# Altium schematic sheet RelayModule_CAN.SchDoc
size 420 x 297 mm; DocumentNumber: VSL.23-RELAYMODULE Э3; SheetNumber: 3; Format: A3
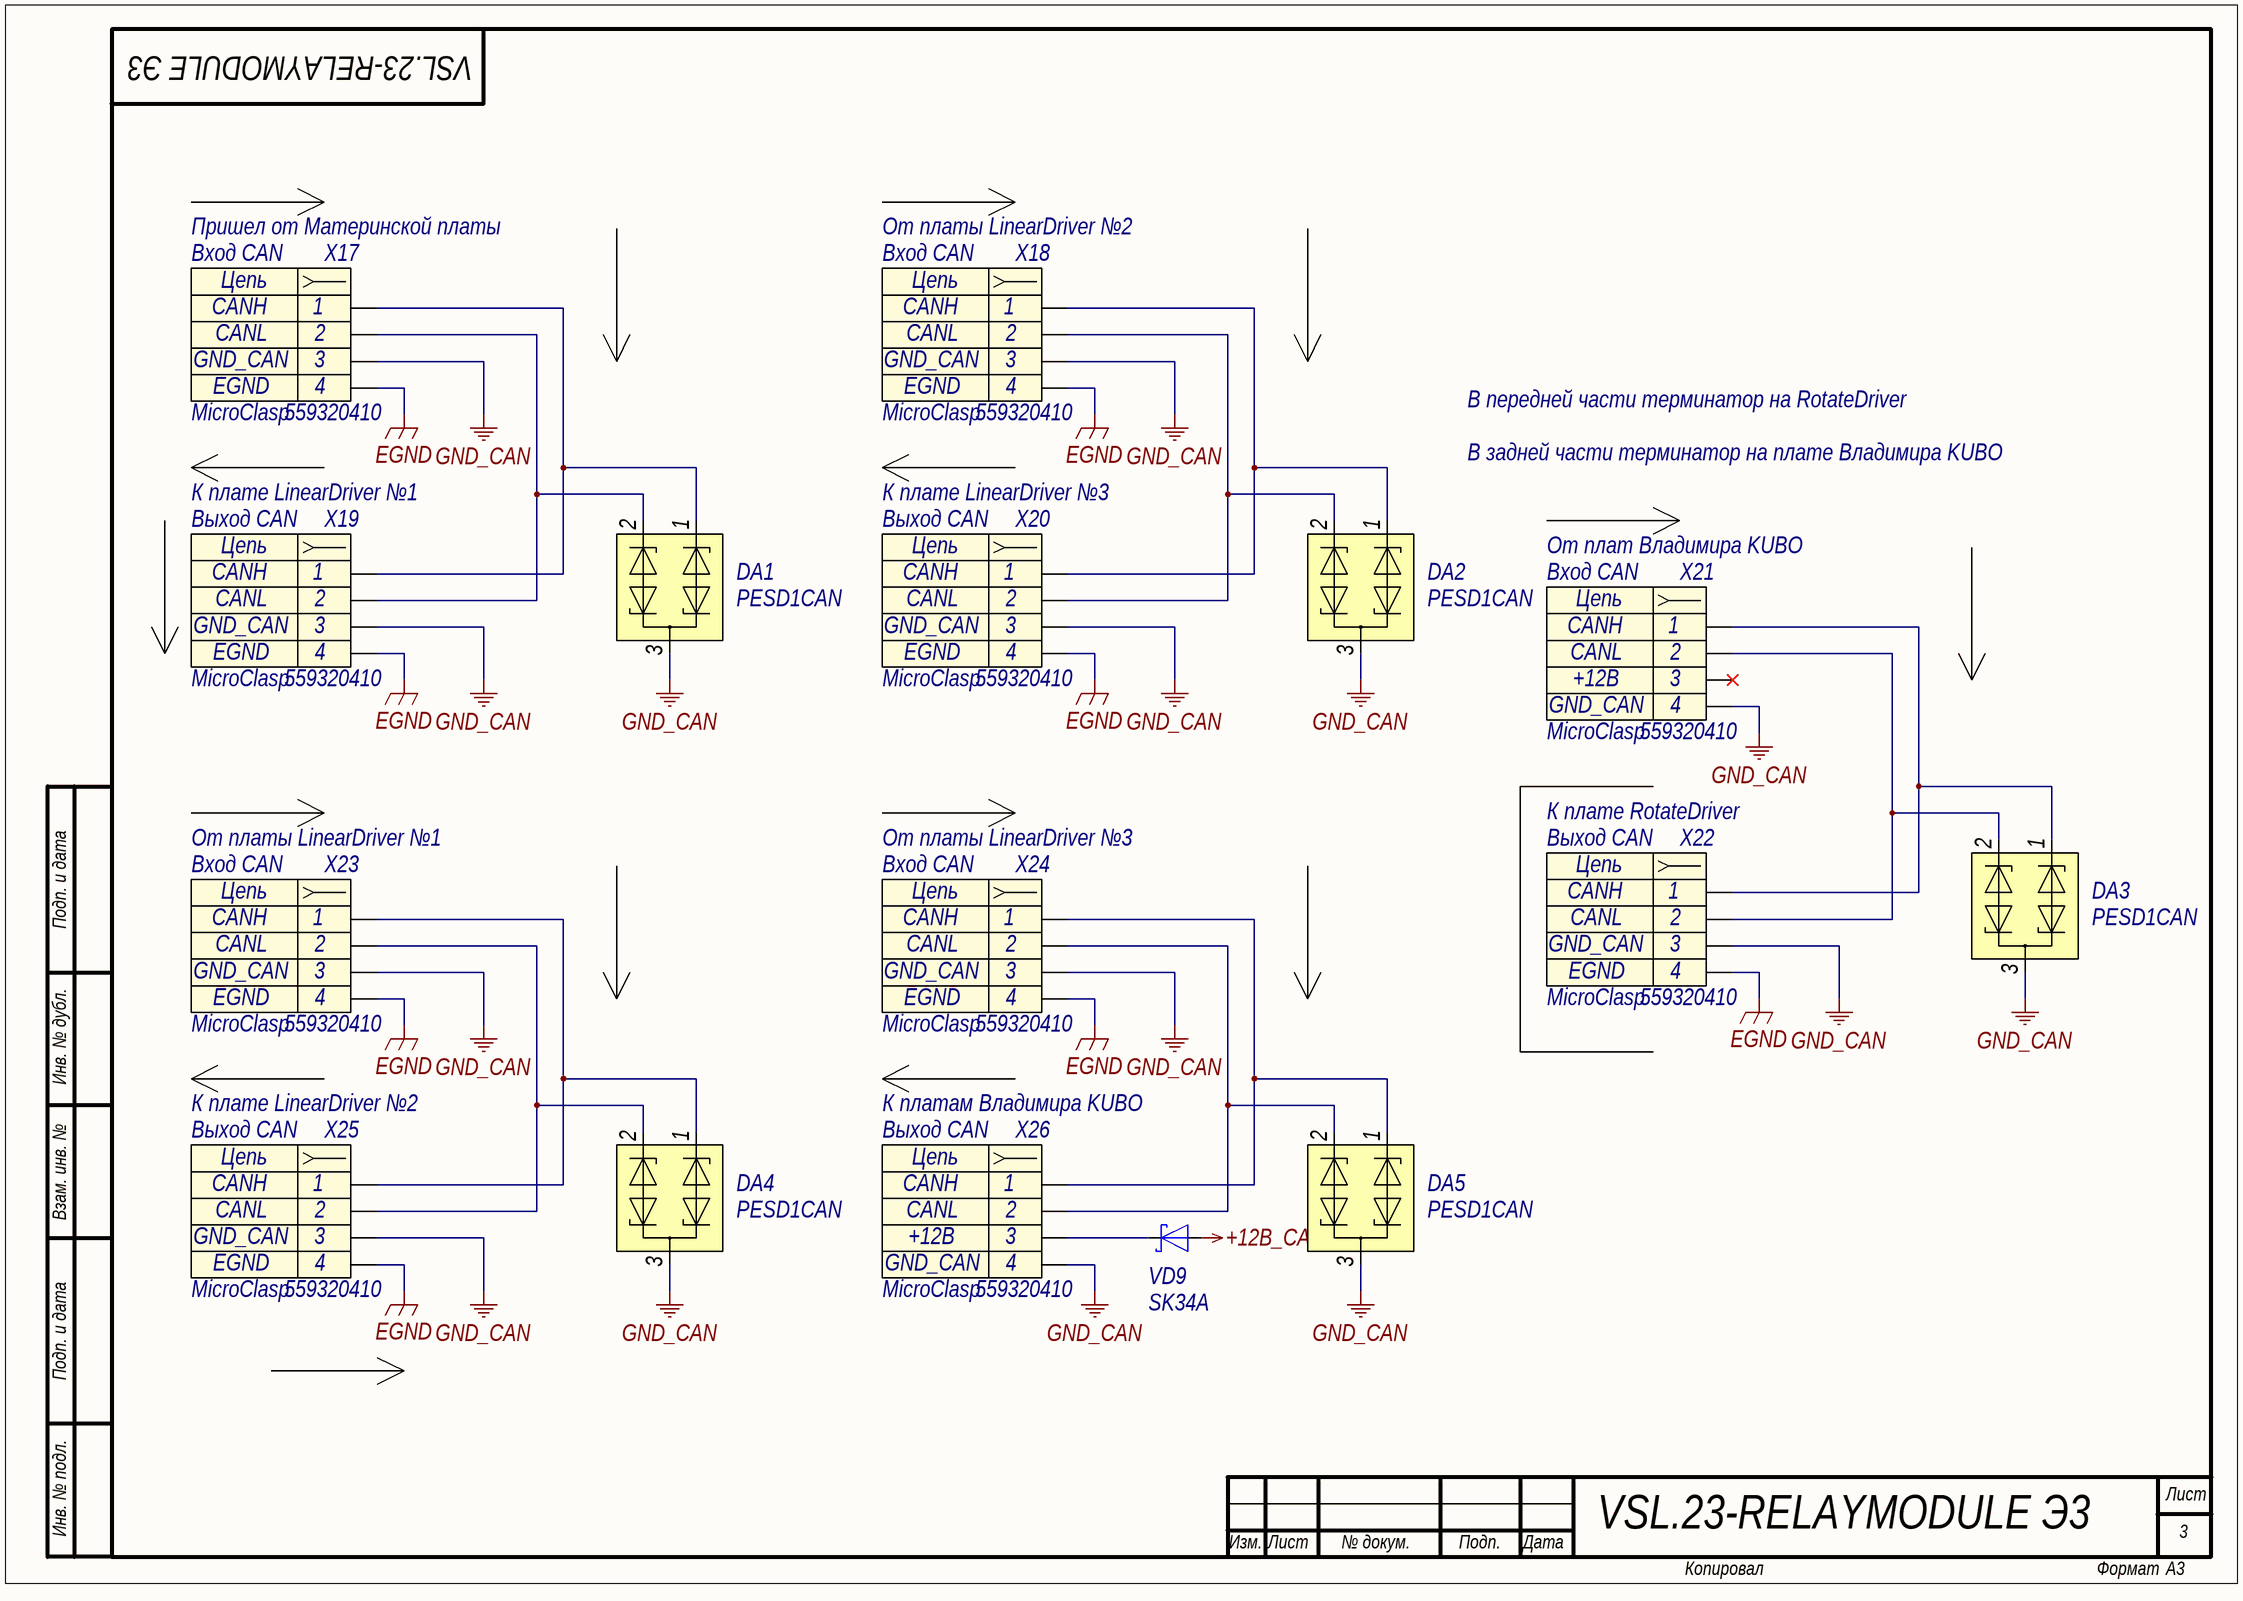
[diagram p0: RelayModule_CAN.SchDoc]

## Parts
DA1  Part Number: PESD1CAN  [SOT23-3]  (hidden comment: PESD)
DA2  Part Number: PESD1CAN  [SOT23-3]  (hidden comment: PESD)
DA3  Part Number: PESD1CAN  [SOT23-3]  (hidden comment: PESD)
DA4  Part Number: PESD1CAN  [SOT23-3]  (hidden comment: PESD)
DA5  Part Number: PESD1CAN  [SOT23-3]  (hidden comment: PESD)
VD9  Part Number: SK34A  [SMA]  (hidden comment: DiodeSchottky)
X17  Вход CAN  Part Name: MicroClasp  Part Number: 559320410  [MOLEX_559320410]
X18  Вход CAN  Part Name: MicroClasp  Part Number: 559320410  [MOLEX_559320410]
X19  Выход CAN  Part Name: MicroClasp  Part Number: 559320410  [MOLEX_559320410]
X20  Выход CAN  Part Name: MicroClasp  Part Number: 559320410  [MOLEX_559320410]
X21  Вход CAN  Part Name: MicroClasp  Part Number: 559320410  [MOLEX_559320410]
X22  Выход CAN  Part Name: MicroClasp  Part Number: 559320410  [MOLEX_559320410]
X23  Вход CAN  Part Name: MicroClasp  Part Number: 559320410  [MOLEX_559320410]
X24  Вход CAN  Part Name: MicroClasp  Part Number: 559320410  [MOLEX_559320410]
X25  Выход CAN  Part Name: MicroClasp  Part Number: 559320410  [MOLEX_559320410]
X26  Выход CAN  Part Name: MicroClasp  Part Number: 559320410  [MOLEX_559320410]

## Nets
+12B_CAN: VD9.2(A)
EGND: X17.4 X18.4 X19.4 X20.4 X22.4 X23.4 X24.4 X25.4
GND_CAN: DA1.3 DA2.3 DA3.3 DA4.3 DA5.3 X17.3 X18.3 X19.3 X20.3 X21.4 X22.3 X23.3 X24.3 X25.3 X26.4
NetDA1_1: DA1.1 X17.1 X19.1
NetDA1_2: DA1.2 X17.2 X19.2
NetDA2_1: DA2.1 X18.1 X20.1
NetDA2_2: DA2.2 X18.2 X20.2
NetDA3_1: DA3.1 X21.1 X22.1
NetDA3_2: DA3.2 X21.2 X22.2
NetDA4_1: DA4.1 X23.1 X25.1
NetDA4_2: DA4.2 X23.2 X25.2
NetDA5_1: DA5.1 X24.1 X26.1
NetDA5_2: DA5.2 X24.2 X26.2
NetVD9_1: VD9.1(K) X26.3

Not connected (* = marked no-connect by the designer): X21 3*

## Notes on the sheet
- Пришел от Материнской платы
- От платы LinearDriver №2
- В передней части терминатор на RotateDriver
- В задней части терминатор на плате Владимира KUBO
- К плате LinearDriver №1
- К плате LinearDriver №3
- От плат Владимира KUBO
- От платы LinearDriver №1
- От платы LinearDriver №3
- К плате RotateDriver
- Подп. и дата
- Инв. № дубл.
- К плате LinearDriver №2
- К платам Владимира KUBO
- Взам. инв. №
- Инв. № подл.
- Лист
- Изм.
- № докум.
- Подп.
- Дата
- Копировал
- Формат
- (in symbol connect97) Цепь

## Library data of the parts
DA1-DA5 = PESD1CAN: TVS; Part Name: CAN bus ESD protection diode; Manufacture: Nexperia; id: esd5; Max Reverse Voltage: 24B; Breakdown Voltage: 25,4B; Capacitance: 17pF; Number of Channels: 2
VD9 = diode1: Диод Шоттки; Manufacture: Taiwan Semiconductor; id: diode1; Max Reverse Voltage: 40B; Forward Voltage: 0,55B; Forward Current: 3A; Part Name: Diode Schottky
X17-X20 X22-X25 = connect97: Разъем - 4 конт. розетка; Manufacture: Molex; Contact_1: CANH; Contact_2: CANL; Contact_3: GND_CAN; Contact_4: EGND; Etch: 2mm; id: connect97
X21 X26 = connect97: Разъем - 4 конт. розетка; Manufacture: Molex; Contact_1: CANH; Contact_2: CANL; Contact_3: +12B; Contact_4: GND_CAN; Etch: 2mm; id: connect97